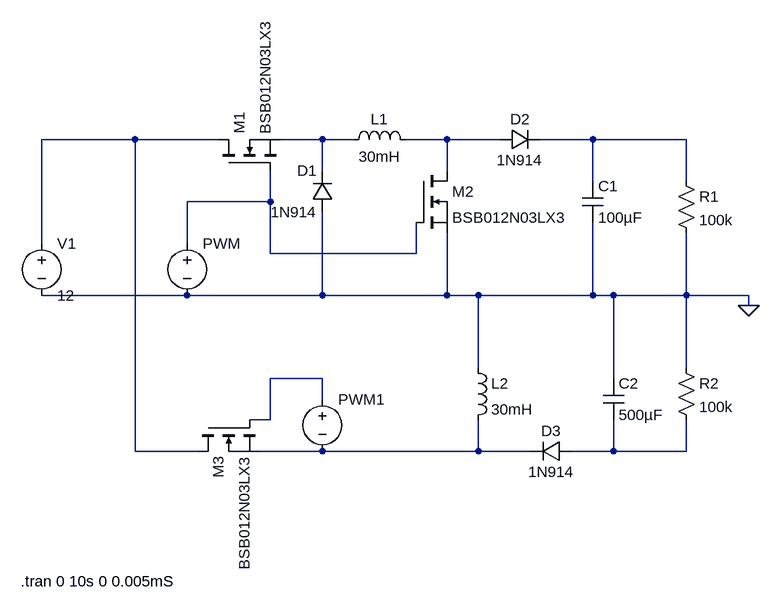
[diagram p0: schematic Dual Output DCDC Converter.asc]
Dual Output DCDC Converter.asc, the LTspice schematic file:
Version 4
SHEET 1 900 680
WIRE -64 -112 -208 -112
WIRE 64 -112 -64 -112
WIRE 224 -112 160 -112
WIRE 272 -112 224 -112
WIRE 416 -112 352 -112
WIRE 496 -112 416 -112
WIRE 640 -112 560 -112
WIRE 784 -112 640 -112
WIRE 224 -64 224 -112
WIRE 416 -64 416 -112
WIRE 640 -48 640 -112
WIRE 784 -48 784 -112
WIRE 144 -16 144 -64
WIRE 144 -16 16 -16
WIRE -208 48 -208 -112
WIRE 16 48 16 -16
WIRE 144 64 144 -16
WIRE 368 64 368 16
WIRE 368 64 144 64
WIRE 16 128 -208 128
WIRE 224 128 224 0
WIRE 224 128 16 128
WIRE 416 128 416 32
WIRE 416 128 224 128
WIRE 464 128 416 128
WIRE 640 128 640 16
WIRE 640 128 464 128
WIRE 672 128 640 128
WIRE 784 128 784 32
WIRE 784 128 672 128
WIRE 880 128 784 128
WIRE 880 144 880 128
WIRE 464 240 464 128
WIRE 784 240 784 128
WIRE 224 256 144 256
WIRE 672 256 672 128
WIRE 224 288 224 256
WIRE 144 320 144 256
WIRE 144 320 112 320
WIRE -64 368 -64 -112
WIRE 32 368 -64 368
WIRE 224 368 128 368
WIRE 464 368 464 320
WIRE 464 368 224 368
WIRE 544 368 464 368
WIRE 672 368 672 320
WIRE 672 368 608 368
WIRE 784 368 784 320
WIRE 784 368 672 368
FLAG 880 144 0
SYMBOL nmos 64 -64 R270
SYMATTR InstName M1
SYMATTR Value BSB012N03LX3
SYMBOL voltage -208 32 R0
WINDOW 123 0 0 Left 0
WINDOW 39 0 0 Left 0
SYMATTR InstName V1
SYMATTR Value 12
SYMBOL diode 240 0 R180
WINDOW 0 24 64 Left 2
WINDOW 3 24 0 Left 2
SYMATTR InstName D1
SYMATTR Value 1N914
SYMBOL nmos 368 -64 R0
SYMATTR InstName M2
SYMATTR Value BSB012N03LX3
SYMBOL cap 624 -48 R0
SYMATTR InstName C1
SYMATTR Value 100µF
SYMATTR SpiceLine V=100
SYMBOL res 768 -64 R0
SYMATTR InstName R1
SYMATTR Value 100k
SYMBOL ind 256 -96 R270
WINDOW 0 32 56 VTop 2
WINDOW 3 5 56 VBottom 2
SYMATTR InstName L1
SYMATTR Value 30mH
SYMBOL diode 496 -96 R270
WINDOW 0 32 32 VTop 2
WINDOW 3 0 32 VBottom 2
SYMATTR InstName D2
SYMATTR Value 1N914
SYMBOL voltage 16 32 R0
WINDOW 3 24 96 Invisible 2
WINDOW 123 0 0 Left 0
WINDOW 39 0 0 Left 0
SYMATTR Value PULSE(0 20 0 0 0 0.125ms 0.25ms 100000000)
SYMATTR InstName PWM
SYMBOL res 768 224 R0
SYMATTR InstName R2
SYMATTR Value 100k
SYMBOL ind 448 224 R0
SYMATTR InstName L2
SYMATTR Value 30mH
SYMBOL cap 656 256 R0
SYMATTR InstName C2
SYMATTR Value 500µF
SYMATTR SpiceLine V=100
SYMBOL diode 608 352 R90
WINDOW 0 0 32 VBottom 2
WINDOW 3 32 32 VTop 2
SYMATTR InstName D3
SYMATTR Value 1N914
SYMBOL nmos 32 320 M90
SYMATTR InstName M3
SYMATTR Value BSB012N03LX3
SYMBOL voltage 224 272 R0
WINDOW 3 24 96 Invisible 2
WINDOW 123 0 0 Left 0
WINDOW 39 0 0 Left 0
SYMATTR Value PULSE(0 20 0.125ms 0 0 0.125ms 0.25ms 100000000)
SYMATTR InstName PWM1
TEXT -240 568 Left 2 !.tran 0 10s 0 0.005mS

The netlist it stands for:
* Dual Output DCDC Converter.asc
M1 N001 N005 N002 N002 BSB012N03LX3
V1 N001 0 12
D1 0 N002 1N914
M2 N003 N005 0 0 BSB012N03LX3
C1 N004 0 100µF V=100
R1 N004 0 100k
L1 N002 N003 30mH
D2 N003 N004 1N914
V§PWM N005 0 PULSE(0 20 0 0 0 0.125ms 0.25ms 100000000)
R2 0 N008 100k
L2 0 N007 30mH
C2 0 N008 500µF V=100
D3 N008 N007 1N914
M3 N001 N006 N007 N007 BSB012N03LX3
V§PWM1 N006 N007 PULSE(0 20 0.125ms 0 0 0.125ms 0.25ms 100000000)
.model D D
.lib standard.dio
.model NMOS NMOS
.model PMOS PMOS
.lib standard.mos
.tran 0 10s 0 0.005mS
.backanno
.end